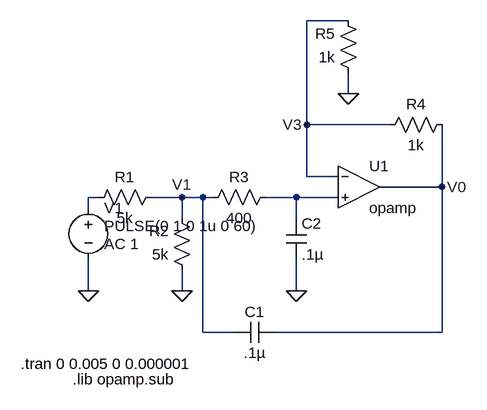
[diagram p0: schematic ecen100_project2_3.asc]
ecen100_project2_3.asc, the LTspice schematic file:
Version 4.1
SHEET 1 880 680
WIRE 368 -368 304 -368
WIRE 368 -256 368 -288
WIRE 304 -208 304 -368
WIRE 432 -208 304 -208
WIRE 304 -128 304 -208
WIRE 352 -128 304 -128
WIRE 512 -112 512 -208
WIRE 512 -112 416 -112
WIRE -16 -96 -32 -96
WIRE 112 -96 64 -96
WIRE 144 -96 112 -96
WIRE 160 -96 144 -96
WIRE 288 -96 240 -96
WIRE 352 -96 288 -96
WIRE -32 -80 -32 -96
WIRE 112 -64 112 -96
WIRE 288 -64 288 -96
WIRE -32 48 -32 0
WIRE 112 48 112 16
WIRE 288 48 288 0
WIRE 144 112 144 -96
WIRE 192 112 144 112
WIRE 512 112 512 -112
WIRE 512 112 256 112
FLAG 112 48 0
FLAG 288 48 0
FLAG -32 48 0
FLAG 368 -256 0
FLAG 112 -96 V1
FLAG 512 -112 V0
FLAG 304 -208 V3
SYMBOL cap 256 96 R90
WINDOW 0 0 32 VBottom 2
WINDOW 3 32 32 VTop 2
SYMATTR InstName C1
SYMATTR Value .1µ
SYMBOL cap 272 -64 R0
SYMATTR InstName C2
SYMATTR Value .1µ
SYMBOL res 80 -112 R90
WINDOW 0 0 56 VBottom 2
WINDOW 3 32 56 VTop 2
SYMATTR InstName R1
SYMATTR Value 5k
SYMBOL res 128 32 R180
WINDOW 0 36 76 Left 2
WINDOW 3 36 40 Left 2
SYMATTR InstName R2
SYMATTR Value 5k
SYMBOL res 144 -80 R270
WINDOW 0 32 56 VTop 2
WINDOW 3 0 56 VBottom 2
SYMATTR InstName R3
SYMATTR Value 400
SYMBOL res 528 -224 R90
WINDOW 0 0 56 VBottom 2
WINDOW 3 32 56 VTop 2
SYMATTR InstName R4
SYMATTR Value 1k
SYMBOL res 384 -272 R180
WINDOW 0 36 76 Left 2
WINDOW 3 36 40 Left 2
SYMATTR InstName R5
SYMATTR Value 1k
SYMBOL OpAmps\\opamp 384 -176 R0
SYMATTR InstName U1
SYMBOL voltage -32 -96 R0
WINDOW 3 24 44 Left 2
WINDOW 123 24 72 Left 2
WINDOW 39 0 0 Left 0
SYMATTR InstName V1
SYMATTR Value PULSE(0 1 0 1u 0 60)
SYMATTR Value2 AC 1
TEXT -56 184 Left 2 !.lib opamp.sub
TEXT -136 160 Left 2 !.tran 0 0.005 0 0.000001

The netlist it stands for:
* ecen100_project2_3.asc
C1 V0 V1 .1µ
C2 N002 0 .1µ
R1 V1 N001 5k
R2 0 V1 5k
R3 V1 N002 400
R4 V0 V3 1k
R5 0 V3 1k
X§U1 V3 N002 V0 opamp Aol=100K GBW=10Meg  ; pins invin noninvin out
V1 N001 0 PULSE(0 1 0 1u 0 60) AC 1
.lib opamp.sub
.tran 0 0.005 0 0.000001
.backanno
.end